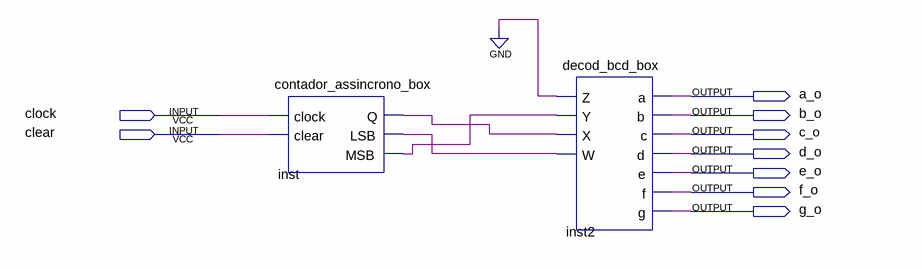
[diagram p0: schematic sheet]
// Quartus schematic contador_assincrono.bdf as structural Verilog: 2 symbols, 9 pins
module contador_assincrono (
  input  clock,
  input  clear,
  output a_o,
  output b_o,
  output c_o,
  output d_o,
  output e_o,
  output f_o,
  output g_o
);

  wire inst_lsb, inst_msb, inst_q;

  contador_assincrono_box inst (.clock(clock), .clear(clear), .Q(inst_q), .LSB(inst_lsb), .MSB(inst_msb));
  decod_bcd_box inst2 (
    .Z(1'b0), .Y(inst_msb), .X(inst_q), .W(inst_lsb), .a(a_o), .b(b_o), .c(c_o), .d(d_o), .e(e_o), .f(f_o),
    .g(g_o));
endmodule
